# Altium schematic sheet IR.SchDoc
size A4
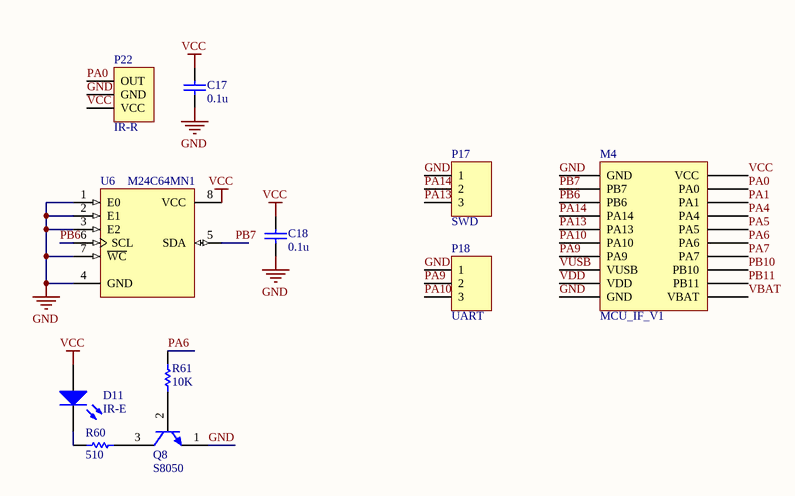
[diagram p0: IR.SchDoc]

## Parts
C17  value 0.1u  [C-1608[0603]]  (hidden comment: Cap Semi)
C18  value 0.1u  [C-1608[0603]]  (hidden comment: Cap Semi)
D11  IR-E  [PIN2]
M4  MCU_IF_V1  [MCU_IF_V1]
P17  SWD  [HDR1X3]
P18  UART  [HDR1X3]
P22  IR-R  [HDR1X3]
Q8  S8050  [SOT23B]
R60  value 510  [R-1608[0603]]  (hidden comment: Res Semi)
R61  value 10K  [R-1608[0603]]  (hidden comment: Res Semi)
U6  M24C64MN1  [SOP8_N]

## Nets
GND: C17.1 C18.1 M4.1(GND) M4.10(GND) P17.1 P18.1 P22.2(GND) Q8.1(E) U6.1(E0) U6.2(E1) U6.3(E2) U6.4(GND) U6.7(~{WC})
VCC: C17.2 C18.2 D11.1(A) M4.20(VCC) P22.3(VCC) U6.8(VCC)
PA0: M4.19(PA0) P22.1(OUT)
PA1: M4.18(PA1)
PA4: M4.17(PA4)
PA5: M4.16(PA5)
PA6: M4.15(PA6) R61.2
PA7: M4.14(PA7)
PA9: M4.7(PA9) P18.2
PA10: M4.6(PA10) P18.3
PA13: M4.5(PA13) P17.3
PA14: M4.4(PA14) P17.2
PB6: M4.3(PB6) U6.6(SCL)
PB7: M4.2(PB7) U6.5(SDA)
PB10: M4.13(PB10)
PB11: M4.12(PB11)
VBAT: M4.11(VBAT)
VDD: M4.9(VDD)
VUSB: M4.8(VUSB)
NetD11_2: D11.2(K) R60.1
NetQ8_2: Q8.2(B) R61.1
NetQ8_3: Q8.3(C) R60.2

## Library data of the parts
C17 C18 = Cap Semi: Capacitor (Semiconductor SIM Model); Published: 8-Jun-2000; LatestRevisionDate: 17-Jul-2002; LatestRevisionNote: Re-released for DXP Platform.; PackageReference: C1206; Publisher: Altium Limited
D11 = LED0: Typical INFRARED GaAs LED; Published: 8-Jun-2000; LatestRevisionDate: 08-Jul-2005; LatestRevisionNote: Mech Layer 1 removed.; PackageReference: LED-0; Publisher: Altium Limited
P17 P18 = Header 3: Header, 3-Pin; LatestRevisionDate: 17-Jul-2002; LatestRevisionNote: Re-released for DXP Platform.; Publisher: Altium Limited
P22 = IR: Header, 3-Pin; LatestRevisionDate: 17-Jul-2002; LatestRevisionNote: Re-released for DXP Platform.; Publisher: Altium Limited
Q8 = 2N3904: NPN General Purpose Amplifier; pin to pad: 1>2 2>1; Published: 8-Jun-2000; LatestRevisionDate: 15-Jan-2003; LatestRevisionNote: PCB Footprint 'BCY-W3/D4.7' replaced; DatasheetDocument: 1997; PackageDocument: Sep-1998; PackageReference: TO-92A; Publisher: Altium Limited; Code_JEDEC: TO-92A; ComponentLink1Description: Manufacturer Link; ComponentLink1URL: http://www.fairchildsemi.com/; ComponentLink2Description: Datasheet; ComponentLink2URL: http://www.fairchildsemi.com/ds/2N%2F2N3904.pdf
R60 R61 = Res Semi: Semiconductor Resistor; Published: 8-Jun-2000; LatestRevisionDate: 17-Jul-2002; LatestRevisionNote: Re-released for DXP Platform.; PackageReference: AXIAL-0.5; Publisher: Altium Limited
U6 = M24C64MN1: 64 Kbit Serial I²C Bus EEPROM; Published: 24-Aug-2001; LatestRevisionDate: 13-Apr-2006; LatestRevisionNote: IPC-7351 Footprint Added.; DatasheetVersion: Jul-1999; PackageVersion: Jul-1999; PackageReference: SOP8; Publisher: Altium Limited; PackageDescription: 8-Pin Small Outline Integrated Circuit 1.27 mm Pitch; ComponentLink1Description: Manufacturer Link; ComponentLink1URL: http://www.st.com/; ComponentLink2Description: Datasheet; ComponentLink2URL: http://www.st.com/stonline/products/literature/ds/4578/m24c32-w.pdf